# Altium schematic sheet sheet1.SchDoc
size Legal; SheetNumber: 1; SheetTotal: 1
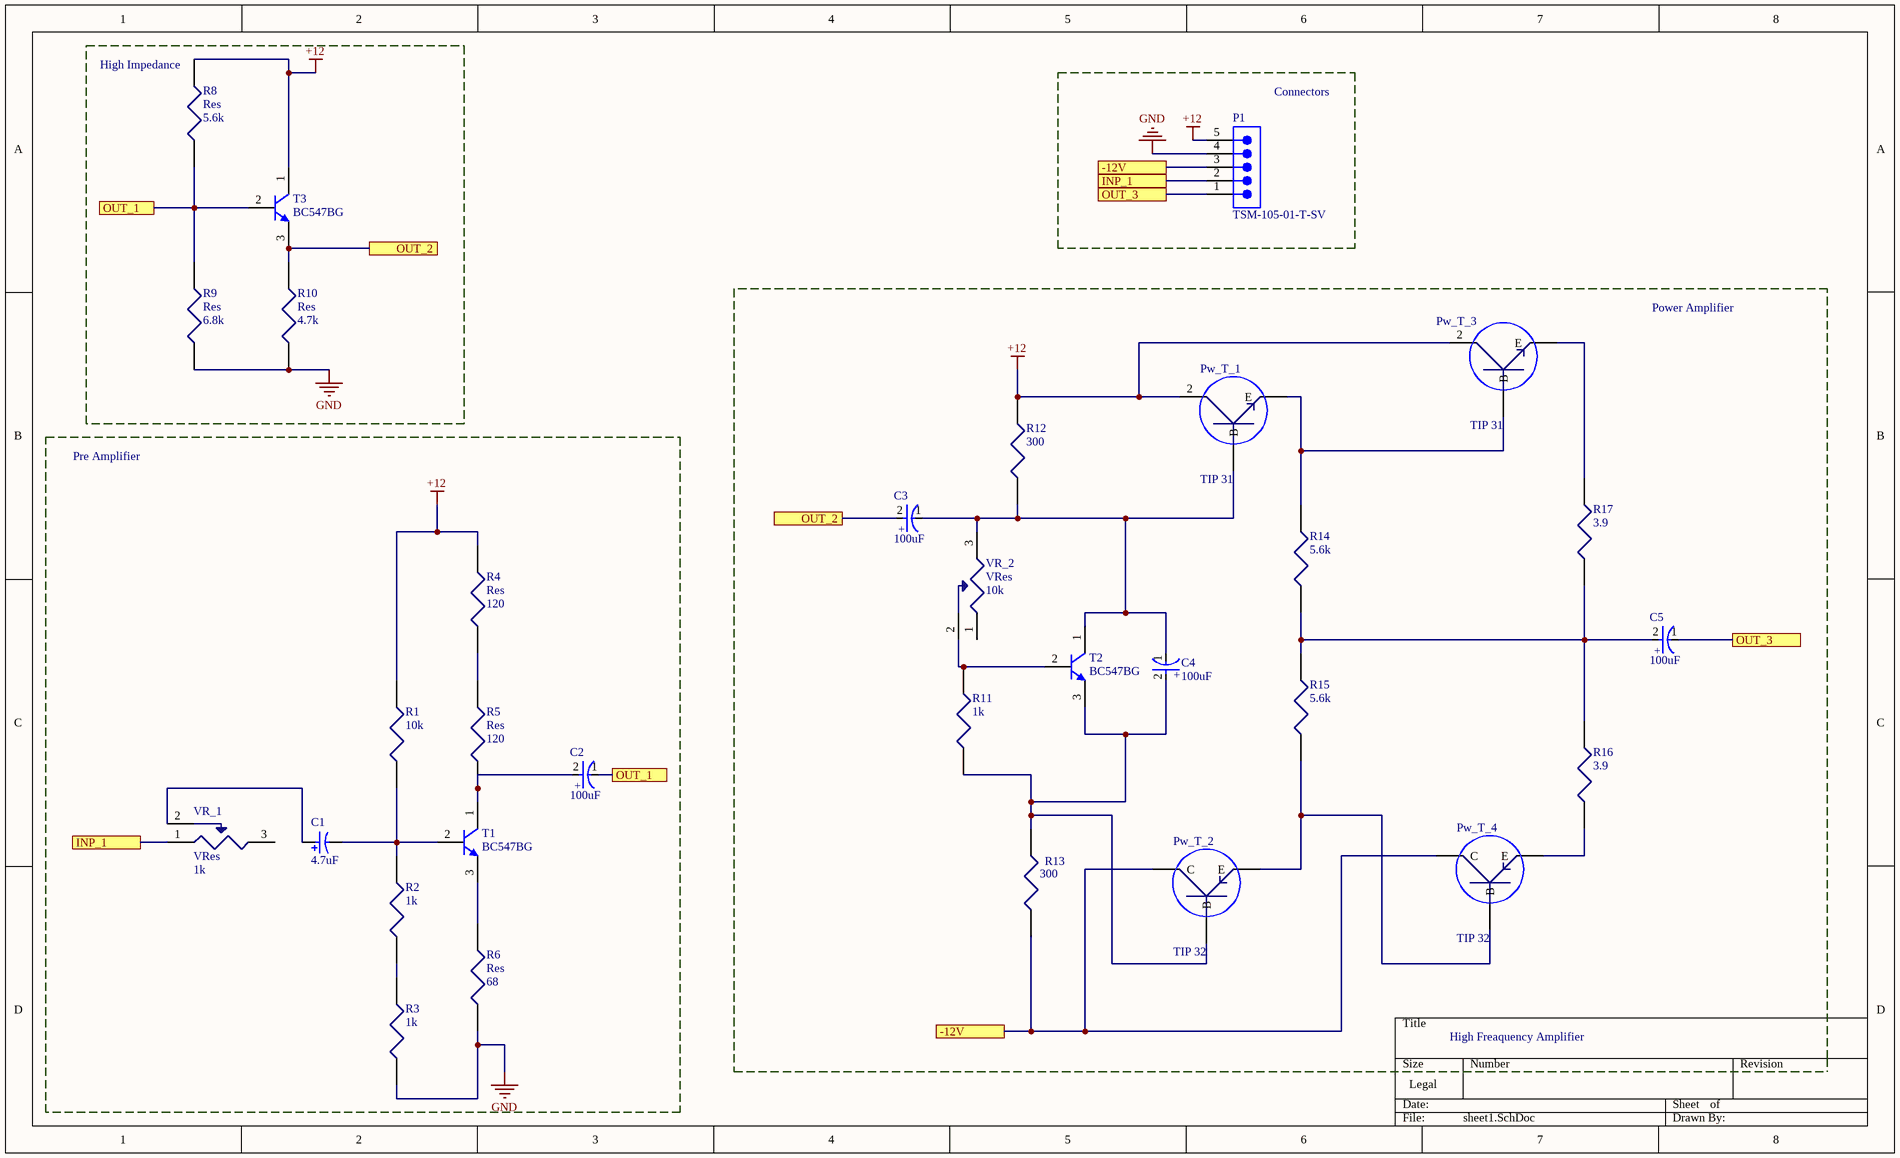
[diagram p0: sheet1.SchDoc]

## Parts
C1  4.7uF  [CAPPR55-200-1100X500X1200]
C2  100uF  [FP-EEU-FR1H101B-MFG]
C3  100uF  [FP-EEU-FR1H101B-MFG]
C4  100uF  [FP-EEU-FR1H101B-MFG]
C5  100uF  [FP-EEU-FR1H101B-MFG]
P1  TSM-105-01-T-SV  [SMTC-TSM-105-01-X-SV]
Pw_T_1  TIP 31  [TIP 31]
Pw_T_2  TIP 32  [TIP 31]
Pw_T_3  TIP 31  [TIP 31]
Pw_T_4  TIP 32  [TIP 31]
R1  value 10k  [Res]
R2  value 1k  [Res]
R3  value 1k  [Res]
R4  Res  value 120  [Res]
R5  Res  value 120  [Res]
R6  Res  value 68  [Res]
R8  Res  value 5.6k  [Res]
R9  Res  value 6.8k  [Res]
R10  Res  value 4.7k  [Res]
R11  value 1k  [Res]
R12  value 300  [Res]
R13  value 300  [Res]
R14  value 5.6k  [Res]
R15  value 5.6k  [Res]
R16  value 3.9  [Res]
R17  value 3.9  [Res]
T1  BC547BG  [ONSC-TO-92-3-29-11]
T2  BC547BG  [ONSC-TO-92-3-29-11]
T3  BC547BG  [ONSC-TO-92-3-29-11]
VR_1  VRes  value 1k  [VerRes]
VR_2  VRes  value 10k  [VerRes]

## Blocks framed on the sheet
High Impedance: R8-R10 T3
Connectors: P1
Pre Amplifier: C1 C2 R1-R6 T1 VR_1

## Ports
-12V, INP_1, OUT_1, OUT_2, OUT_3

## Nets
+12: P1.5 Pw_T_1.2 Pw_T_3.2 R1.2 R4.2 R8.2 R12.2 T3.1(C)
GND: P1.4 R3.1 R6.1 R9.1 R10.1
-12V: P1.3 Pw_T_2.2(C) Pw_T_4.2(C) R13.1 ; port -12V
INP_1: P1.2 VR_1.1 ; port INP_1
OUT_1: C2.1(C) R8.1 R9.2 T3.2(B) ; port OUT_1
OUT_2: C3.2(A) R10.2 T3.3(E) ; port OUT_2
OUT_3: C5.1(C) P1.1 ; port OUT_3
NetC1_1: C1.1 VR_1.2
NetC1_2: C1.2 R1.1 R2.2 T1.2(B)
NetC2_2: C2.2(A) R5.1 T1.1(C)
NetC3_1: C3.1(C) C4.1(C) Pw_T_1.1(B) R12.1 T2.1(C) VR_2.3
NetC4_2: C4.2(A) Pw_T_2.1(B) R11.1 R13.2 T2.3(E)
NetC5_2: C5.2(A) R14.1 R15.2 R16.2 R17.1
NetPw_T_1_3: Pw_T_1.3(E) Pw_T_3.1(B) R14.2
NetPw_T_2_3: Pw_T_2.3(E) Pw_T_4.1(B) R15.1
NetPw_T_3_3: Pw_T_3.3(E) R17.2
NetPw_T_4_3: Pw_T_4.3(E) R16.1
NetR2_1: R2.1 R3.2
NetR4_1: R4.1 R5.2
NetR6_2: R6.2 T1.3(E)
NetR11_2: R11.2 T2.2(B) VR_2.2

Not connected (* = marked no-connect by the designer): VR_1 3; VR_2 1

## Notes on the sheet
- Power Amplifier
- High Freaquency Amplifier
- (in symbol CMP-05427-000020-1) +

## Library data of the parts
C1 = CMP-1665-00037-2: Aluminum Electrolytic Capacitor, 4.7 uF, +/- 20%, 50 V, -40 to 85 degC, 2-Pin THD, RoHS, Bulk; Manufacturer: Panasonic; Life (Hours): 2000Hour; Dielectric Material: Aluminium; Voltage Rating: 50V; Leakage Current: 3uA; Ripple Current: 45mA; Lead/Base Style: Straight; Dissipation Factor: 0.12%; Lead Diameter: 0.5mm; Package Description: 2-Pin Radial Lead, Dia 5 mm, Height 12 mm; REACH SVHC: NoSVHC; RoHSCompliant: true; Height: 11mm; Package Reference: CAPPR55-200-1100X500X1200; Datasheet URL: https://industrial.panasonic.com/cdbs/www-data/pdf/RDF0000/ABA0000C1218.pdf; Lead Pitch: 2mm; Diameter: 5mm; Voltage Rating (DC): 50V; Voltage: 50V; Termination: Radial; Min Operating Temperature: -40degC; Package Quantity: 200; Max Operating Temperature: 85degC; Length: 11mm; Mount: ThroughHole; Number of Pins: 2; Lead Free: LeadFree; Ripple Current (AC): 45mA; Datasheet Version: Rev. 05, 10/2016; Width: 0inch; Capacitance: 4.7uF; Case/Package: Radial; Tolerance: 20%; Manufacturer URL: http://www.panasonic.com/; Height - Seated (Max): 0.472inch; Packaging: Bulk; Radiation Hardening: No
C2-C5 = CMP-05427-000020-1: CAP ALUM 100UF 20% 50V RADIAL; Life (Hours): 6000Hour; Ripple Current: 870mA; Lead Diameter: 0.6mm; Impedance: 61mR; Tolerance: 20%; Mount: Through Hole; Lead Free: Lead Free; Length: 11.5mm; Height - Seated (Max): 0.512inch; Contact Plating: Tin; Termination: Radial; Series: FR; Max Operating Temperature: 105°C; Features: General Purpose; Min Operating Temperature: -40°C; RoHS Compliant: Yes; Height: 11.5mm; Voltage Rating (DC): 50V; Diameter: 8mm; Capacitance: 100uF; Lead Pitch: 5mm; Radiation Hardening: No; Package Quantity: 1; Case/Package: Radial; Voltage Rating: 50V; Packaging: Tape and Reel; ESR (Equivalent Series Resistance): 61mR; REACH SVHC: No SVHC
P1 = CMP-1024-00239-1: 0.025" SQ Post Header, Surface Mount, Vertical, -55 to 105 degC, 2.54 mm Pitch, 5-Pin, Male, RoHS; Manufacturer: Samtec; Pitch: 2.54 mm; PartNumber: TSM-105-01-T-SV; ComponentLink3Description: Package Specification; PackageDescription: Single Row .100 SMT Assembly; ComponentLink2URL: http://www.samtec.com/documents/webfiles/pdf/TSM.PDF; RoHS: True; ComponentLink2Description: Datasheet; Mounting Technology: Surface Mount; DatasheetVersion: F-214; ComponentLink1Description: Manufacturer URL; ComponentLink3URL: http://www.samtec.com/documents/webfiles/cpdf/TSM-1XX-XX-XXX-SV-XX-XXX-XX-MKT.pdf; Orientation: Vertical; PackageVersion: BP, 8/2002; PackageReference: TSM-105-01-X-SV; ComponentLink1URL: http://www.samtec.com; Temperature Range: -55 to 105 degC
R1-R3 R11-R17 = Res
T1-T3 = CMP-1048-01469-1: Amplifier Transistor, NPN Silicon, 3-Pin TO-92, Pb-Free, Bulk Box; Manufacturer: On Semiconductor; IC Continuous (A): 0.1; fT Min (MHz): 150; Packing: Bulk Box; RoHS: TRUE; PackageVersion: Rev. AM; Mounting Technology: Through Hole; Polarity: NPN; PackageReference: TO-92-3-29-11_AM_SL; DatasheetVersion: Rev. 7; ComponentLink2URL: http://www.onsemi.com/pub_link/Collateral/BC546-D.PDF; ComponentLink1Description: Manufacturer URL; ComponentLink3URL: http://www.onsemi.cn/pub_link/Collateral/2N6426-D.PDF; PackageDescription: 3-Pin Transistor Outline, Body 4.825 x 3.685 mm, Pitch 1.27 mm; ComponentLink2Description: Datasheet; ComponentLink1URL: http://www.onsemi.com/; PartNumber: BC547BG; ComponentLink3Description: Package Specification